# EAGLE design WattMeter-PowerSocket-Controller V0.100 (EAGLE 7.7.0)
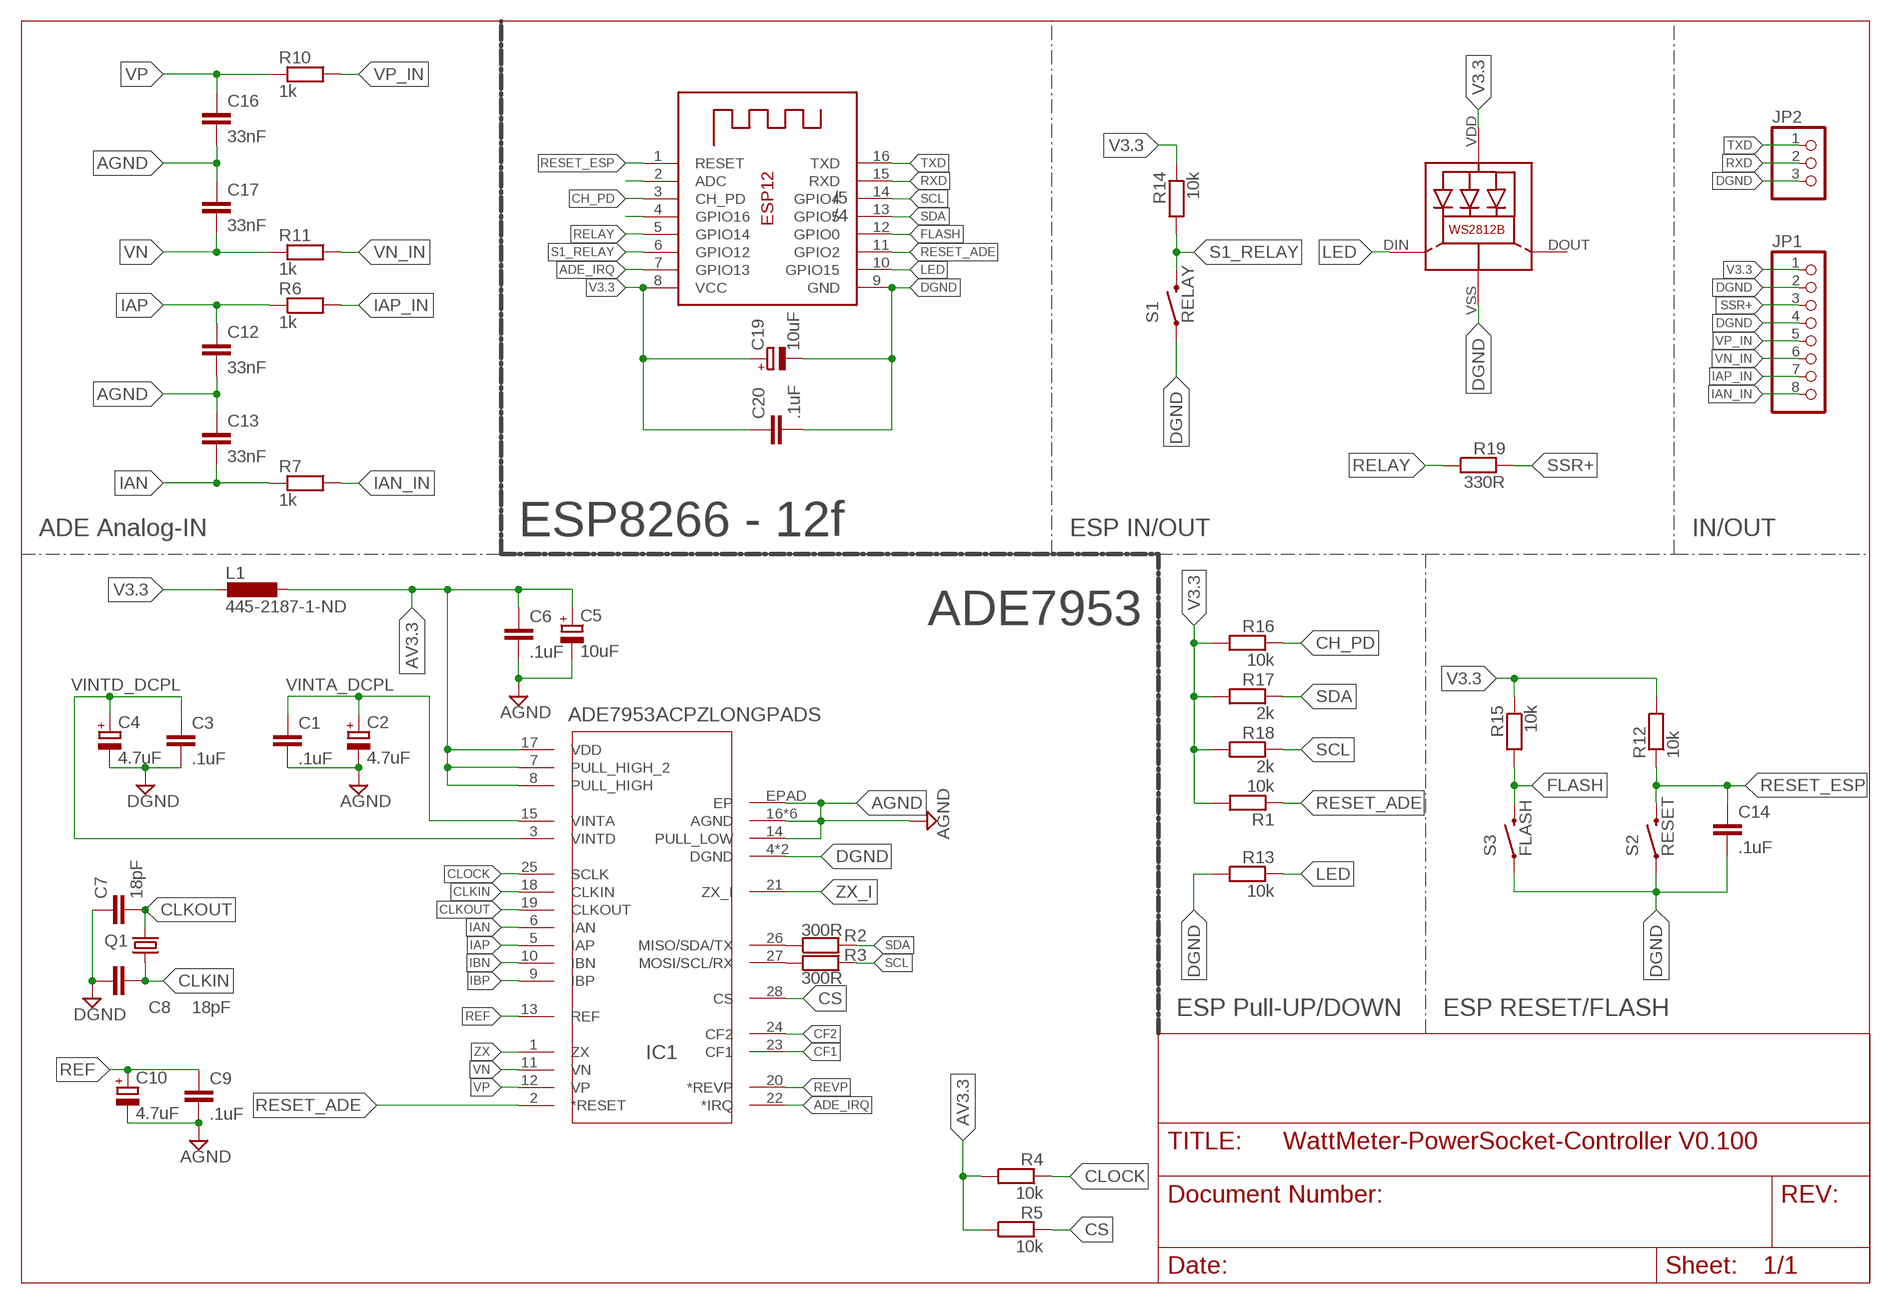
[diagram p0: schematic, sheet 1]

## Parts
C1  .1uF  C-EUC0805K  [C0805K@1]
C2  4.7uF  CPOL-EUA/3216-18R  [A/3216-18R]
C3  .1uF  C-EUC0805K  [C0805K@1]
C4  4.7uF  CPOL-EUA/3216-18R  [A/3216-18R]
C5  10uF  CPOL-EUA/3216-18R  [A/3216-18R]
C6  .1uF  C-EUC0805K  [C0805K@1]
C7  18pF  C-EUC0805K  [C0805K@1]
C8  18pF  C-EUC0805K  [C0805K@1]
C9  .1uF  C-EUC0805K  [C0805K@1]
C10  4.7uF  CPOL-EUA/3216-18R  [A/3216-18R]
C12  33nF  C-EUC0805K  [C0805K@1]
C13  33nF  C-EUC0805K  [C0805K@1]
C14  .1uF  C-EUC0805K  [C0805K@1]
C16  33nF  C-EUC0805K  [C0805K@1]
C17  33nF  C-EUC0805K  [C0805K@1]
C19  10uF  CPOL-EUA/3216-18R  [A/3216-18R]
C20  .1uF  C-EUC0805K  [C0805K@1]
IC1  ADE7953ACPZLONGPADS  ADE7953ACPZ5.0  [VQFN-28-D]
JP1  PINHD-1X8  [1X08]
JP2  PINHD-1X3  [1X03]
L1  445-2187-1-ND  L-EUL2012C  [L2012C]
LED1  WS2812B  [WS2812B]
Q1  535-10200-1-ND  CRYSTALSM49  [SM49]
R1  10k  R-US_R0805  [R0805@1]
R2  300R  R-US_R0805  [R0805@1]
R3  300R  R-US_R0805  [R0805@1]
R4  10k  R-US_R0805  [R0805@1]
R5  10k  R-US_R0805  [R0805@1]
R6  1k  R-US_R0805  [R0805@1]
R7  1k  R-US_R0805  [R0805@1]
R10  1k  R-US_R0805  [R0805@1]
R11  1k  R-US_R0805  [R0805@1]
R12  10k  R-US_R0805  [R0805@1]
R13  10k  R-US_R0805  [R0805@1]
R14  10k  R-US_R0805  [R0805@1]
R15  10k  R-US_R0805  [R0805@1]
R16  10k  R-US_R0805  [R0805@1]
R17  2k  R-US_R0805  [R0805@1]
R18  2k  R-US_R0805  [R0805@1]
R19  330R  R-US_R0805  [R0805@1]
S1  RELAY  SWITCH-MOMENTARY-2SMD  [TACTILE-SWITCH-SMD]
S2  RESET  SWITCH-MOMENTARY-2SMD-1101NE  [TACTILE-SWITCH-1101NE]
S3  FLASH  SWITCH-MOMENTARY-2SMD-1101NE  [TACTILE-SWITCH-1101NE]
X1  ESP-12  [ESP-12]

## Nets
ADC: X1.2(ADC)
ADE_IRQ: IC1.22(*IRQ) X1.7(GPIO13)
AGND: C1.2 C2.- C5.- C6.2 C9.2 C10.- C12.2 C13.1 C16.2 C17.1 IC1.14(PULL_LOW) IC1.16(AGND) IC1.29(AGND) IC1.30(AGND) IC1.31(AGND) IC1.32(AGND) IC1._AGND(AGND) IC1.EPAD(EP)
AV3.3 [ic]: C5.+ C6.1 IC1.7(PULL_HIGH_2) IC1.8(PULL_HIGH) IC1.17(VDD) L1.1 R4.2 R5.2
CF1 [ic]: IC1.23(CF1)
CF2 [ic]: IC1.24(CF2)
CH_PD: R16.1 X1.3(CH_PD)
CLKIN [ic]: C8.2 IC1.18(CLKIN) Q1.1
CLKOUT [ic]: C7.2 IC1.19(CLKOUT) Q1.2
CLOCK [ic]: IC1.25(SCLK) R4.1
CS [ic]: IC1.28(CS) R5.1
DGND: C3.2 C4.- C7.1 C8.1 C14.2 C19.- C20.2 IC1.4(DGND) IC1._DGND(DGND) JP1.2 JP1.4 JP2.3 LED1.VSS(GND) R13.2 S1.1 S2.1 S3.1 X1.9(GND)
FLASH: R15.2 S3.2 X1.12(GPIO0)
GPIO16: X1.4(GPIO16)
IAN [ic]: C13.2 IC1.6(IAN) R7.1
IAN_IN: JP1.8 R7.2
IAP [ic]: C12.1 IC1.5(IAP) R6.1
IAP_IN: JP1.7 R6.2
IBN [ic]: IC1.10(IBN)
IBP [ic]: IC1.9(IBP)
LED: LED1.DIN(DI) R13.1 X1.10(GPIO15)
PIN26_MISO_SDA_TX [ic]: IC1.26(MISO/SDA/TX) R2.1
PIN27_MOSI_SCL_RX [ic]: IC1.27(MOSI/SCL/RX) R3.1
REF [ic]: C9.1 C10.+ IC1.13(REF)
RELAY: R19.2 X1.5(GPIO14)
RESET_ADE [ic]: IC1.2(*RESET) R1.1 X1.11(GPIO2)
RESET_ESP: C14.1 R12.1 S2.2 X1.1(RESET)
REVP [ic]: IC1.20(*REVP)
RXD: JP2.2 X1.15(RXD)
S1_RELAY: R14.2 S1.3 X1.6(GPIO12)
SCL: R3.2 R18.1 X1.14(GPIO4)
SDA: R2.2 R17.1 X1.13(GPIO5)
SSR+: JP1.3 R19.1
TXD: JP2.1 X1.16(TXD)
V3.3: C19.+ C20.1 JP1.1 L1.2 LED1.VDD R1.2 R12.2 R14.1 R15.1 R16.2 R17.2 R18.2 X1.8(VCC)
VINTA_DCPL [ic]: C1.1 C2.+ IC1.15(VINTA)
VINTD_DCPL [ic]: C3.1 C4.+ IC1.3(VINTD)
VN [ic]: C17.2 IC1.11(VN) R11.1
VN_IN: JP1.6 R11.2
VP [ic]: C16.1 IC1.12(VP) R10.1
VP_IN: JP1.5 R10.2
ZX [ic]: IC1.1(ZX)
ZX_I [ic]: IC1.21(ZX_I)
Unconnected: LED1.DOUT(DO)

## Notes on the sheet
- /5
- /4
- ADE Analog-IN | ESP8266 - 12f | ESP IN/OUT | IN/OUT
- ADE7953
- ESP Pull-UP/DOWN | ESP RESET/FLASH

## Library data of the parts
C1 C3 C6-C9 C12-C14 C16 C17 C20 = resistor:C-EU: CAPACITOR, European symbol
C2 C4 C5 C10 C19 = resistor:CPOL-EU: POLARIZED CAPACITOR, European symbol
IC1 = ade7953-2:ADE7953ACPZ
JP1 = pinhead:PINHD-1X8: PIN HEADER
JP2 = pinhead:PINHD-1X3: PIN HEADER
L1 = resistor:L-EU: INDUCTOR, European symbol
LED1 = WS2812B:WS2812B: Features and Benefits  * Intelligent reverse connect protection, the power supply reverse connection does not damage the IC. * The control circuit and the LED share the only power source. Control circuit and RGB chip are integrated in a package of 5050 components, form a complete control of pixel point.  * Built-in signal reshaping circuit, after wave reshaping to the next driver, ensure wave-form distortion not accumulate.  * Built-in electric reset circuit and power lost reset circuit.  * Each pixel of the three primary color can achieve 256 brightness display, completed 16777216 color full color display, and scan frequency not less than 400Hz/s.  * Cascading port transmission signal by single line.  * Any two point the distance more than 5m transmission signal without any increase circuit.  * When the refresh rate is 30fps, cascade number are not less than1024 points.  * Send data at speeds of 800Kbps.  *The color of the light were highly consistent, cost-effective. Applications  Full-color module, Full color soft lights a lamp strip. LED decorative lighting, Indoor/outdoor LED video irregular screen. General description WS2812B is a intelligent control LED light source that the control circuit and RGB chip are integrated in a package of 5050 components. It internal include intelligent digital port data latch and signal reshaping amplification drive circuit. Also include a precision internal oscillator and a 12V voltage programmable constant curre-nt control part, effectively ensuring the pixel point light color height consistent. The data transfer protocol use single NZR communication mode. After the pixel power-on reset, the DIN port receive data from controller, the first pixel collect initial 24bit data then sent to the internal data latch, the other data which reshaping by the internal signal reshaping amplification circuit sent to the next cascade pixel through the DO port. After transmission for each pixel,the signal to reduce 24bit. pixel adopt auto reshaping transmit technology, making the pixel cascade number is not limited the signal transmission, only depend on the speed of signal transmission. LED with low driving voltage, environmental protection and energy saving, high brightness, scattering angle is large, good consistency, low power, long life and other advantages. The control chip integrated in LED above becoming more simple circuit, small volume, convenient installation. Absolute Maximum Ratings Power supply voltage: VDD +3.5V..+5.3V Input voltage: VI -0.5V..VDD+0.5V based on WS2812 from https://github.com/adafruit/Adafruit-Eagle-Library
Q1 = crystal:CRYSTAL: CRYSTAL; OC_FARNELL: unknown; OC_NEWARK: unknown
R1-R7 R10-R19 = resistor:R-US_: RESISTOR, American symbol
S1 = SparkFun-Electromechanical:SWITCH-MOMENTARY-2: Various NO switches- pushbuttons, reed, etc; PROD_ID: SWCH-08247
S2 S3 = SparkFun-Electromechanical:SWITCH-MOMENTARY-2: Various NO switches- pushbuttons, reed, etc; PROD_ID: SWCH-00815
X1 = adafruit:ESP-12

## Net classes
0 default: width 0.203 mm, drill 0.508 mm, clearance 0.254 mm
1 HIGHVOLTAGE: width 0.254 mm, drill 0.508 mm, clearance 2.413 mm to class 0, clearance 1.27 mm
2 ic: width 0.152 mm, drill 0.305 mm, clearance 0.152 mm to class 0, clearance 2.413 mm to class 1, clearance 0.152 mm

## Board
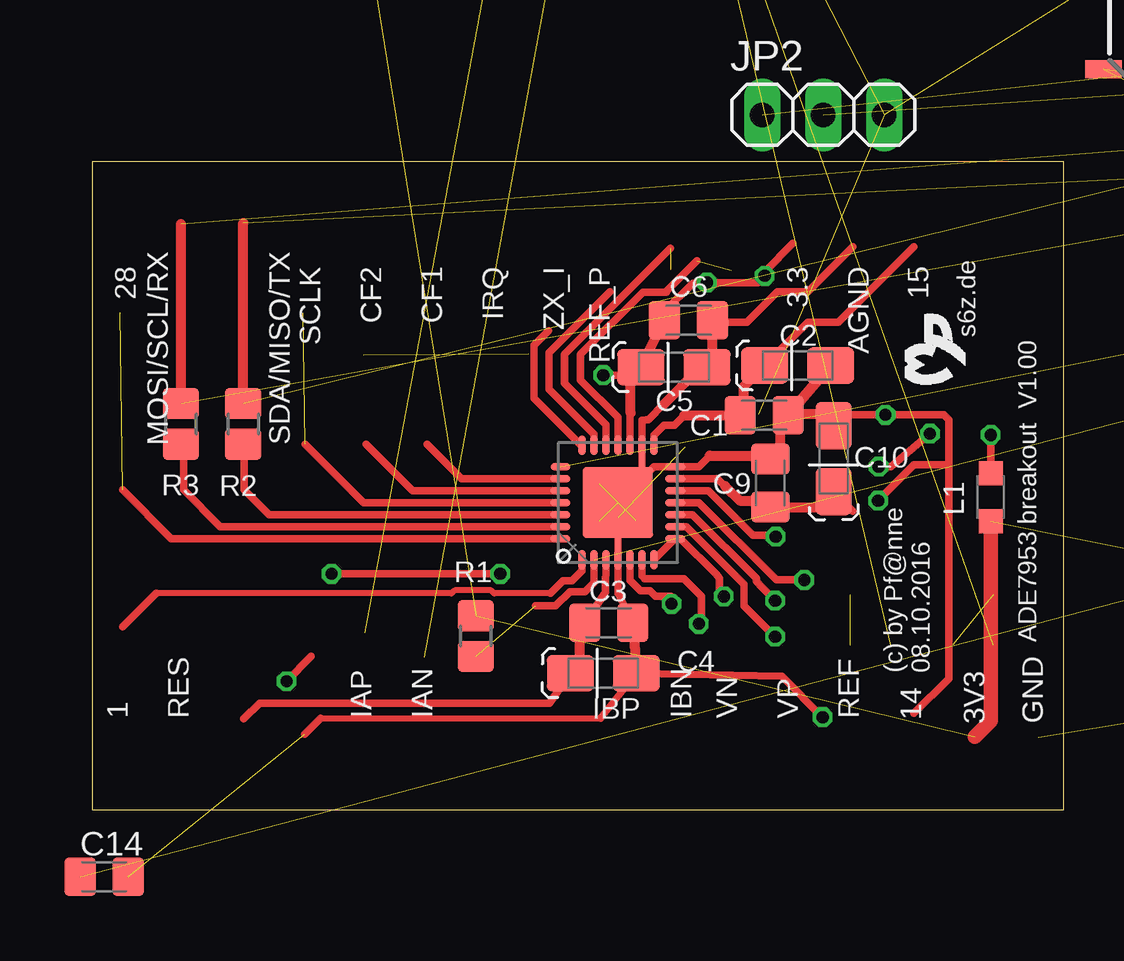
[diagram p1: board, top side]
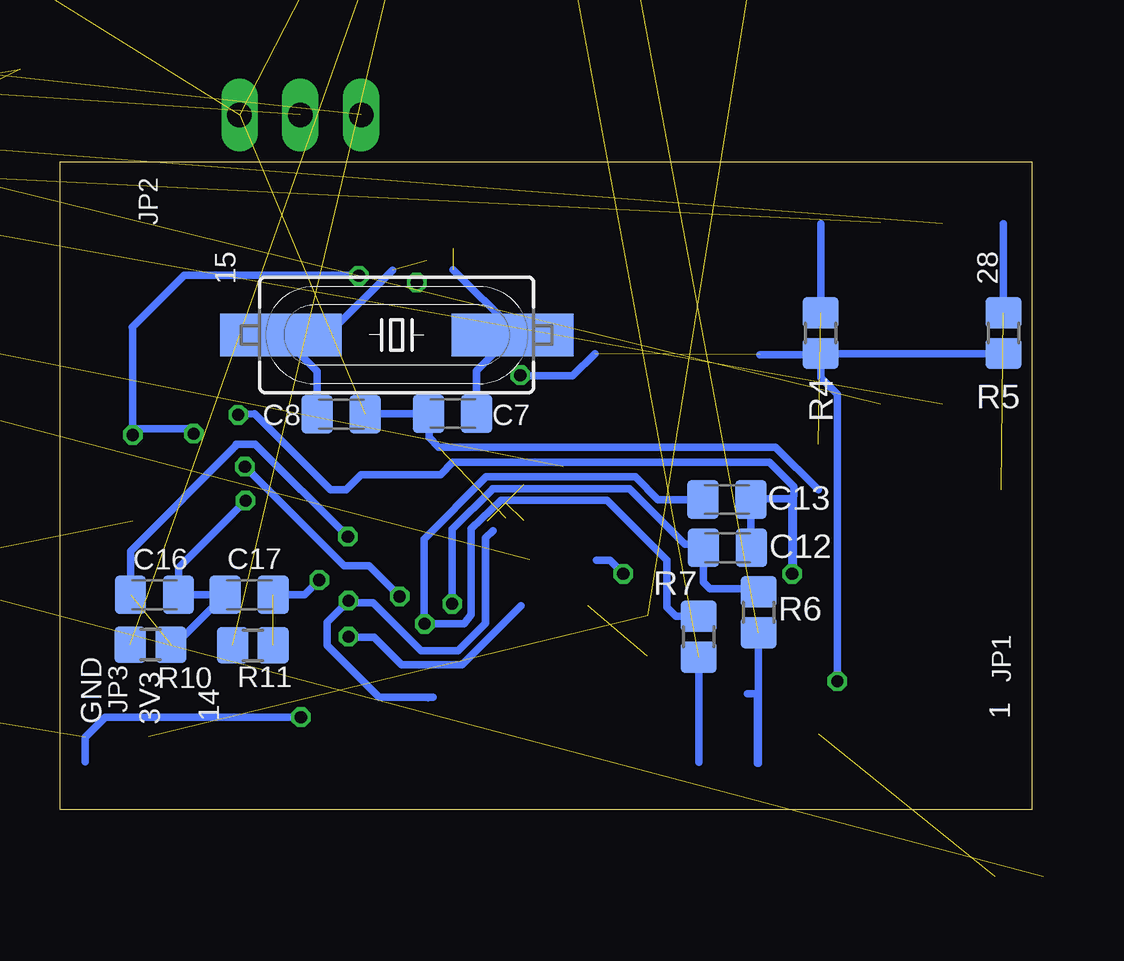
[diagram p2: board, bottom side, seen from below]

Size 40.5 x 27 mm. Coordinates in mm from the lower left corner, seen from the top.
Outline: 40.5,27 0,27 0,0 40.5,0 40.5,27
Copper layers (1*16): Top 0.035mm / dielectric 1.5mm / Bottom 0.035mm
Design rules "dirtypcbs_v1.0": minimum track width 5mil, minimum drill 12mil, track to track 5mil, track to pad 5mil, pad to pad 5mil, via to via 5mil, smd to smd 0mil, copper to edge 10mil, drill to drill 10mil, minimum pad ring 10mil, minimum via ring 6mil, stop-mask expansion 2mil, vias tented up to drill 25mil, thermal gap 10mil

### Footprints (pad centres in the part's own frame; a part is rotated, then mirrored left to right if it is on the bottom)
C0805K@1 = smd 1.3 x 1.6: 1 -1,0; 2 1,0
A/3216-18R = smd 1.95 x 1.5: + 1.375,0; - -1.375,0
VQFN-28-D = smd 0.813 x 0.305: 1 -2.388,1.5; 2 -2.388,1; 3 -2.388,0.5; 4 -2.388,0; 5 -2.388,-0.5; 6 -2.388,-1; 7 -2.388,-1.5; 15 2.388,-1.5; 16 2.388,-1; 17 2.388,-0.5; 18 2.388,0; 19 2.388,0.5; 20 2.388,1; 21 2.388,1.5 | smd 0.305 x 0.813: 8 -1.5,-2.388; 9 -1,-2.388; 10 -0.5,-2.388; 11 0,-2.388; 12 0.5,-2.388; 13 1,-2.388; 14 1.5,-2.388; 22 1.5,2.388; 23 1,2.388; 24 0.5,2.388; 25 0,2.388; 26 -0.5,2.388; 27 -1,2.388; 28 -1.5,2.388 | smd 1.016 x 1.016: 29 -0.762,0.762; 30 -0.762,-0.762; 31 0.762,0.762; 32 0.762,-0.762 | smd 0.762 x 0.203: _AGND 1.778,-1; _DGND -1.651,0 | smd 2.946 x 2.946: EPAD 0,0
1X08 = drill 1.016 long: 1 -8.89,0; 2 -6.35,0; 3 -3.81,0; 4 -1.27,0; 5 1.27,0; 6 3.81,0; 7 6.35,0; 8 8.89,0
1X03 = drill 1.016 long: 1 -2.54,0; 2 0,0; 3 2.54,0
L2012C = smd 1 x 1: 1 -1,0; 2 1,0
WS2812B = smd 2 x 1.1: DIN 2,1.7; DOUT -2,-1.7; VDD -2,1.7; VSS 2,-1.7
SM49 = smd 5.08 x 1.778: 1 -4.826,0; 2 4.826,0
R0805@1 = smd 1.3 x 1.5: 1 -0.85,0; 2 0.85,0
TACTILE-SWITCH-SMD = smd 1.524 x 0.762: 1 -2.794,1.905; 2 2.794,1.905; 3 -2.794,-1.905; 4 2.794,-1.905
TACTILE-SWITCH-1101NE = smd 2.3 x 1.6: 1 -3.15,0; 2 3.15,0
ESP-12 = smd 2 x 1.2: 1 -7.5,4.5; 2 -7.5,2.5; 3 -7.5,0.5; 4 -7.5,-1.5; 5 -7.5,-3.5; 6 -7.5,-5.5; 7 -7.5,-7.5; 8 -7.5,-9.5; 9 7.5,-9.5; 10 7.5,-7.5; 11 7.5,-5.5; 12 7.5,-3.5; 13 7.5,-1.5; 14 7.5,0.5; 15 7.5,2.5; 16 7.5,4.5

### Placement (x,y rotation side)
C1  28.02,16.43 0 top
C2  29.41,18.52 180 top
C3  21.54,7.8 0 top
C4  21.31,5.69 180 top
C5  24.26,18.44 180 top
C6  24.87,20.4 0 top
C7  24.13,16.51 0 bottom
C8  28.78,16.48 180 bottom
C9  28.27,13.61 90 top
C10  30.91,14.63 270 top
C12  12.67,10.92 0 bottom
C13  12.7,12.93 180 bottom
C14  0.51,-2.79 0 top
C16  36.56,8.96 0 bottom
C17  32.61,8.96 0 bottom
C19  96.01,16.26 0 top  (outside the outline)
C20  92.96,10.41 0 top  (outside the outline)
IC1  21.92,12.8 90 top
JP1  15.75,65.02 0 top  (outside the outline)
JP2  30.48,28.96 0 top
L1  37.47,13.03 270 top
LED1  82.8,22.1 0 top  (outside the outline)
Q1  26.47,19.79 0 bottom
R1  16,7.24 90 top
R2  6.3,16.08 90 top
R3  3.71,16.08 90 top
R4  8.79,19.86 270 bottom
R5  1.17,19.86 270 bottom
R6  11.38,8.23 270 bottom
R7  13.87,7.21 270 bottom
R10  36.72,6.88 180 bottom
R11  32.46,6.86 180 bottom
R12  54.1,11.43 0 top  (outside the outline)
R13  93.22,27.43 0 top  (outside the outline)
R14  93.22,22.1 0 top  (outside the outline)
R15  53.85,8.89 0 top  (outside the outline)
R16  93.22,43.43 0 top  (outside the outline)
R17  93.22,38.1 0 top  (outside the outline)
R18  93.22,32.77 0 top  (outside the outline)
R19  93.22,5.08 0 top  (outside the outline)
S1  44.96,32.77 0 top  (outside the outline)
S2  72.14,12.95 0 top  (outside the outline)
S3  61.21,6.1 0 top  (outside the outline)
X1  64.14,29.21 0 top  (outside the outline)

### Tracks (layer width: path | path; a pad name or v marks a point on that pad's centre or on a via)
ADE_IRQ  (1 unrouted)
AGND  (via drill 0.51)  (3 unrouted)
  Top 0.305: 23.08,13.96 23.42,14.3 IC1.14 25.3,14.3 25.76,14.76 | 23.08,13.96 IC1.32 IC1.30 | 23.08,13.96 22.92,14.11 IC1._AGND IC1.16 22.92,16.24 23.11,16.26 23.19,16.26 23.85,16.92 | 31.04,15.88 C10.- 31.37,16.46 v33.07,16.46 35.51,16.46 35.71,16.26 35.71,14.48 | 31.73,23.47 29.84,21.59 28.57,21.59 27.3,20.32 25.94,20.32 C6.2 | v17.02,9.83 v9.98,9.83 | v32.77,12.88 34.27,14.38 35.61,14.38 35.71,14.48 | 34.27,4.01 35.71,5.46 35.71,14.48
  Top 0.406: 25.76,14.76 28.13,14.76 C9.2 28.7,15.05 28.7,16.51 C1.2 | C1.2 29.09,16.51 30.48,16.51 C10.- | C1.2 C2.- | 23.85,16.92 25.23,18.29 25.65,18.29 C5.- 26.04,18.41 25.87,18.58 C6.2
  Bottom 0.305: C12.2 11.7,11.58 C13.1 11.46,12.93 11.43,12.95 9.93,12.95 9.93,10.01 10.16,9.78 v9.98,9.83 9.98,13.01 9.91,13.08 9.91,13.46 10.92,14.48 24.13,14.48 24.64,13.97 27.94,13.97 28.57,13.34 29.21,13.34 32.38,16.51 v33.07,16.46 | 18.13,10.39 17.58,10.39 v17.02,9.83 | 35.69,6.88 C17.1 C16.2 35.56,10.08 v32.77,12.88
AV3.3  (via drill 0.5, 0.51)  (1 unrouted)
  Top 0.305: IC1.7 IC1.8 24.54,11.3 26.01,9.83 26.16,9.65 26.16,9.07 v26.34,8.89 | IC1.17 22.42,16.5 22.45,16.54 | C6.1 23.87,20.77 25.04,21.95 25.6,21.95 v25.63,21.97 27.76,21.97 v28.04,22.25 28.04,22.43 29.21,23.6 | v32.79,14.3 33.3,14.3 v34.92,15.67 | L1.1 v37.47,15.62 | 9.13,6.39 v8.1,5.36 | v21.31,18.11 22.55,18.11 C5.+
  Top 0.406: 22.45,16.54 22.45,17.75 C5.+ C6.1
  Bottom 0.305: v32.79,14.3 28.65,10.16 27.61,10.16 v26.34,8.89 | v34.92,15.67 35.13,15.88 37.47,15.88 v37.47,15.62 37.47,20.09 37.49,20.12 35.33,22.28 28.04,22.28 v28.04,22.25 | R5.2 R4.2 | R4.2 8.79,18.01 8.1,17.32 v8.1,5.36 | R4.2 8.84,18.96 11.33,18.96 | 18.2,19.01 19.13,18.09 21.29,18.09 v21.31,18.11
CF1
  Top 0.305: IC1.23 15.41,13.8 13.97,15.24
CF2
  Top 0.305: IC1.24 13.37,13.3 11.43,15.24
CH_PD  (1 unrouted)
CLKIN  (1 unrouted)
  Top 0.305: 25.22,22.89 23.95,21.61 23.95,21.57 22.96,21.57 20.37,18.97 20.37,17.91 21.92,16.36 IC1.18
  Bottom 0.305: 26.64,22.48 29.34,19.79 Q1.1 29.78,18.27 C8.2
CLKOUT  (1 unrouted)
  Top 0.305: IC1.19 21.42,16.05 19.68,17.78 19.68,18.97 24.11,23.39
  Bottom 0.305: 24.11,22.5 21.64,20.04 Q1.2 23.13,18.3 C7.2
CLOCK  (1 unrouted)
  Top 0.305: IC1.25 11.33,12.8 8.89,15.24
  Bottom 0.305: R4.1 8.79,24.41
CS  (1 unrouted)
  Top 0.305: IC1.28 3.3,11.3 1.27,13.34
  Bottom 0.305: R5.1 1.17,24.41
DGND  (via drill 0.51)  (13 unrouted)
  Top 0.254: 9.53,3.81 21.19,3.81
  Top 0.305: 8.87,3.15 9.53,3.81 | 21.19,3.81 C4.- 28.75,5.56 v30.45,3.86 | C3.2 21.92,9.02 IC1.4 IC1._DGND 21.92,12.17
  Top 0.406: 22.61,7.73 C3.2 C4.-
  Bottom 0.305: v30.45,3.86 38.61,3.86 39.45,3.02 39.45,2.01 | 8.89,13.34 10.67,15.11 24.71,15.11 25.12,15.52 C7.1 27.68,16.51 C8.1
FLASH  (2 unrouted)
IAN  (via drill 0.51)
  Top 0.305: IC1.6 22.92,9.74 23.04,9.63 24.66,9.63 25.4,8.89 25.4,7.85 v25.3,7.75
  Bottom 0.305: 25.35,7.8 25.32,7.77 | 25.22,7.67 v25.3,7.75 | 25.32,7.77 25.32,11.28 22.73,13.87 16.51,13.87 15.57,12.93 C13.2 | 25.32,7.77 v25.3,7.75 | v25.3,7.75 23.65,7.75 23.37,8.13 23.37,11.71 22.12,12.9 17.7,12.9 15.19,10.39 15.19,8.43 14.82,8.06 R7.1
IAN_IN  (1 unrouted)
  Bottom 0.305: R7.2 13.87,1.98
IAP  (via drill 0.51)
  Top 0.305: v24.16,8.59 24.13,8.89 23.5,8.89 23.27,9.12 22.86,9.12 22.42,9.56 IC1.5
  Bottom 0.305: R6.1 11.52,9.22 13.41,9.22 13.68,9.48 C12.1 13.82,11.06 14.45,11.07 16.76,13.39 22.48,13.39 22.48,13.36 24.16,11.68 v24.16,8.59 24.18,8.61
IAP_IN  (1 unrouted)
  Bottom 0.305: R6.2 11.38,1.93 11.43,1.93 11.43,4.83 11.85,4.83
IBN  (via drill 0.51)
  Top 0.305: IC1.10 25.04,12.3 27.69,9.65 27.69,9.53 27.94,9.25 v28.47,8.71
  Bottom 0.305: 22.45,11.63 22.76,11.33 22.76,7.77 23.9,6.63 25.45,6.63 27.46,8.64 28.4,8.64 v28.47,8.71 29.36,7.82 29.36,6.86 27.2,4.7 25.15,4.7 | 24.94,4.7 25.15,4.7 | 25.15,4.66 25.15,4.7
IBP  (via drill 0.51)
  Top 0.305: IC1.9 24.77,11.8 27.18,9.4 27.18,8.51 v28.47,7.21
  Bottom 0.305: 21.29,8.51 23.75,6.04 26.26,6.04 27.41,7.19 28.45,7.19 v28.47,7.21
LED  (2 unrouted)
PIN26_MISO_SDA_TX
  Top 0.305: IC1.26 7.38,12.3 6.35,13.34 6.35,15.18 R2.1
PIN27_MOSI_SCL_RX
  Top 0.305: IC1.27 5.34,11.8 3.81,13.34 3.81,15.13 R3.1
REF
  Top 0.305: IC1.13 26.08,13.8 26.39,13.49 | 31.73,12.44 C10.+
  Top 0.406: 26.39,13.49 27,12.88 28.01,12.88 C9.1 30.27,12.61 C10.+
RELAY  (1 unrouted)
RESET_ADE  (2 unrouted)
  Top 0.305: IC1.2 20.92,9.46 20.55,9.09 19.91,9.09 19.33,8.51 18.48,8.51
RESET_ESP  (3 unrouted)
REVP
  Top 0.305: IC1.20 20.92,15.66 19.05,17.53 19.05,19.05 21.59,21.59
RXD  (1 unrouted)
S1_RELAY  (2 unrouted)
SCL  (2 unrouted)
  Top 0.406: R3.2 3.71,24.41
SDA  (2 unrouted)
  Top 0.406: R2.2 6.3,24.46
SSR+  (1 unrouted)
TXD  (1 unrouted)
V3.3  (12 unrouted)
  Top 0.61: L1.2 37.47,3.71 36.8,3.05
VINTA_DCPL
  Top 0.305: IC1.15 23.42,15.6 23.85,16.03 24.28,16.03 24.69,16.43 | 34.27,23.47 31.11,20.32 29.84,20.32 C2.+
  Top 0.406: C2.+ 27.18,17.66 27.18,16.26 C1.1 24.69,16.43
VINTD_DCPL
  Top 0.305: 6.33,3.79 6.99,4.45 19.07,4.45 C4.+ | IC1.3 21.41,9.07 C3.1
  Top 0.406: C3.1 20.32,7.62 20.32,5.69 C4.+
VN  (via drill 0.51)  (1 unrouted)
  Top 0.305: IC1.11 25.3,12.8 28.52,9.58 v29.69,9.58
  Bottom 0.305: C17.2 30.31,8.96 v29.69,9.58
VN_IN  (1 unrouted)
VP  (via drill 0.51)  (1 unrouted)
  Top 0.305: IC1.12 25.69,13.3 27.56,11.43 28.3,11.43 v28.5,11.38
  Bottom 0.305: v28.5,11.38 32.36,15.24 33.15,15.24 33.15,15.19 37.56,10.78 C16.1 37.57,8.95
VP_IN  (1 unrouted)
ZX
  Top 0.254: 19.1,9.02 16.76,9.02 16.64,9.14 15.11,9.14 14.99,9.02 2.67,9.02
  Top 0.305: 19.1,9.02 19.63,9.55 20.02,9.55 20.42,9.96 IC1.1 | 2.67,9.02 1.27,7.62
ZX_I
  Top 0.305: IC1.21 20.42,15.14 18.41,17.14 18.41,19.36 19.02,19.96

### Text on the board
tNames: 28 | MOSI/SCL/RX | SDA/MISO/TX | SCLK | CF2 | CF1 | IRQ | ZX_I | REF_P | 3.3 | AGND | 15 | s6z.de | ADE7953 breakout V1.00 | (c) by Pf@nne / 08.10.2016 | IBP | 1 | RES | IAP | IAN | IBN | VN | VP | REF | 14 | 3V3 | GND
bNames: JP2 | 28 | 15 | JP1 | 1 | 14 | 3V3 | JP3 | GND